# Altium project CSI2-ZCU106-EVK_Rev01.PrjPcb
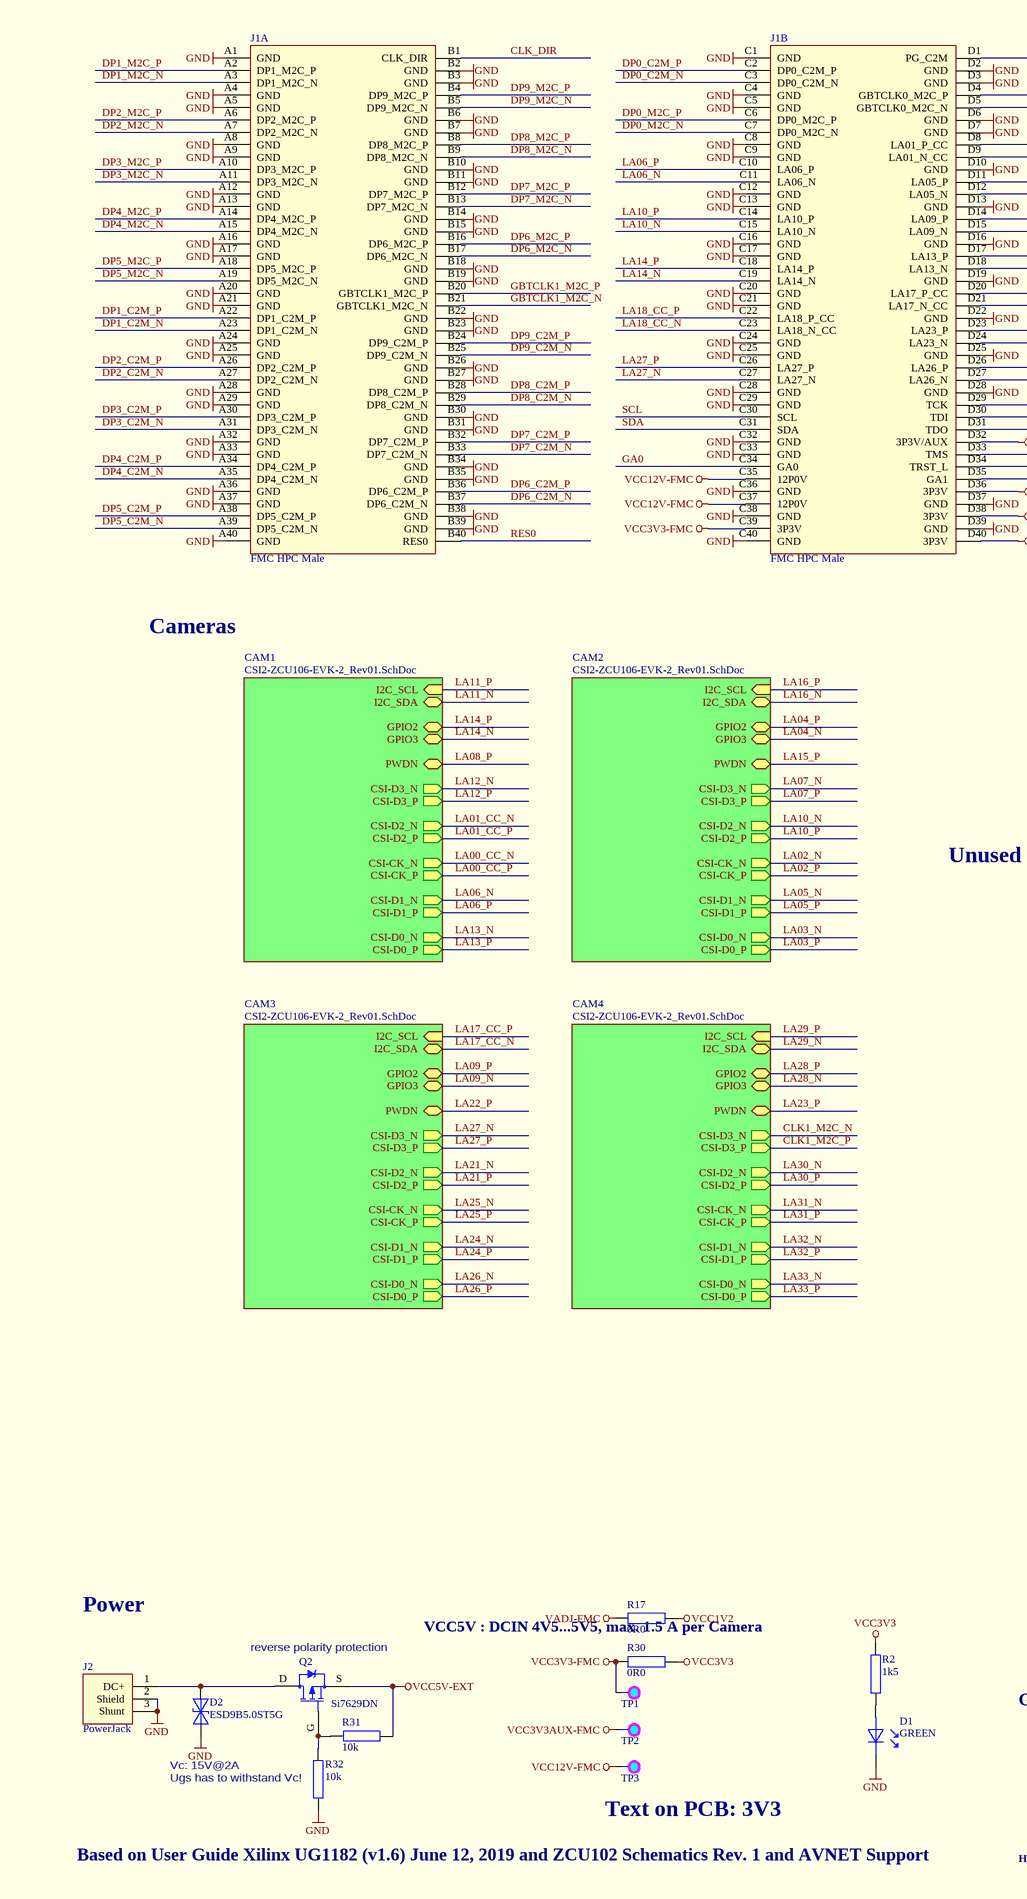
[diagram p0: CSI2-ZCU106-EVK-1_Rev01.SchDoc, left]
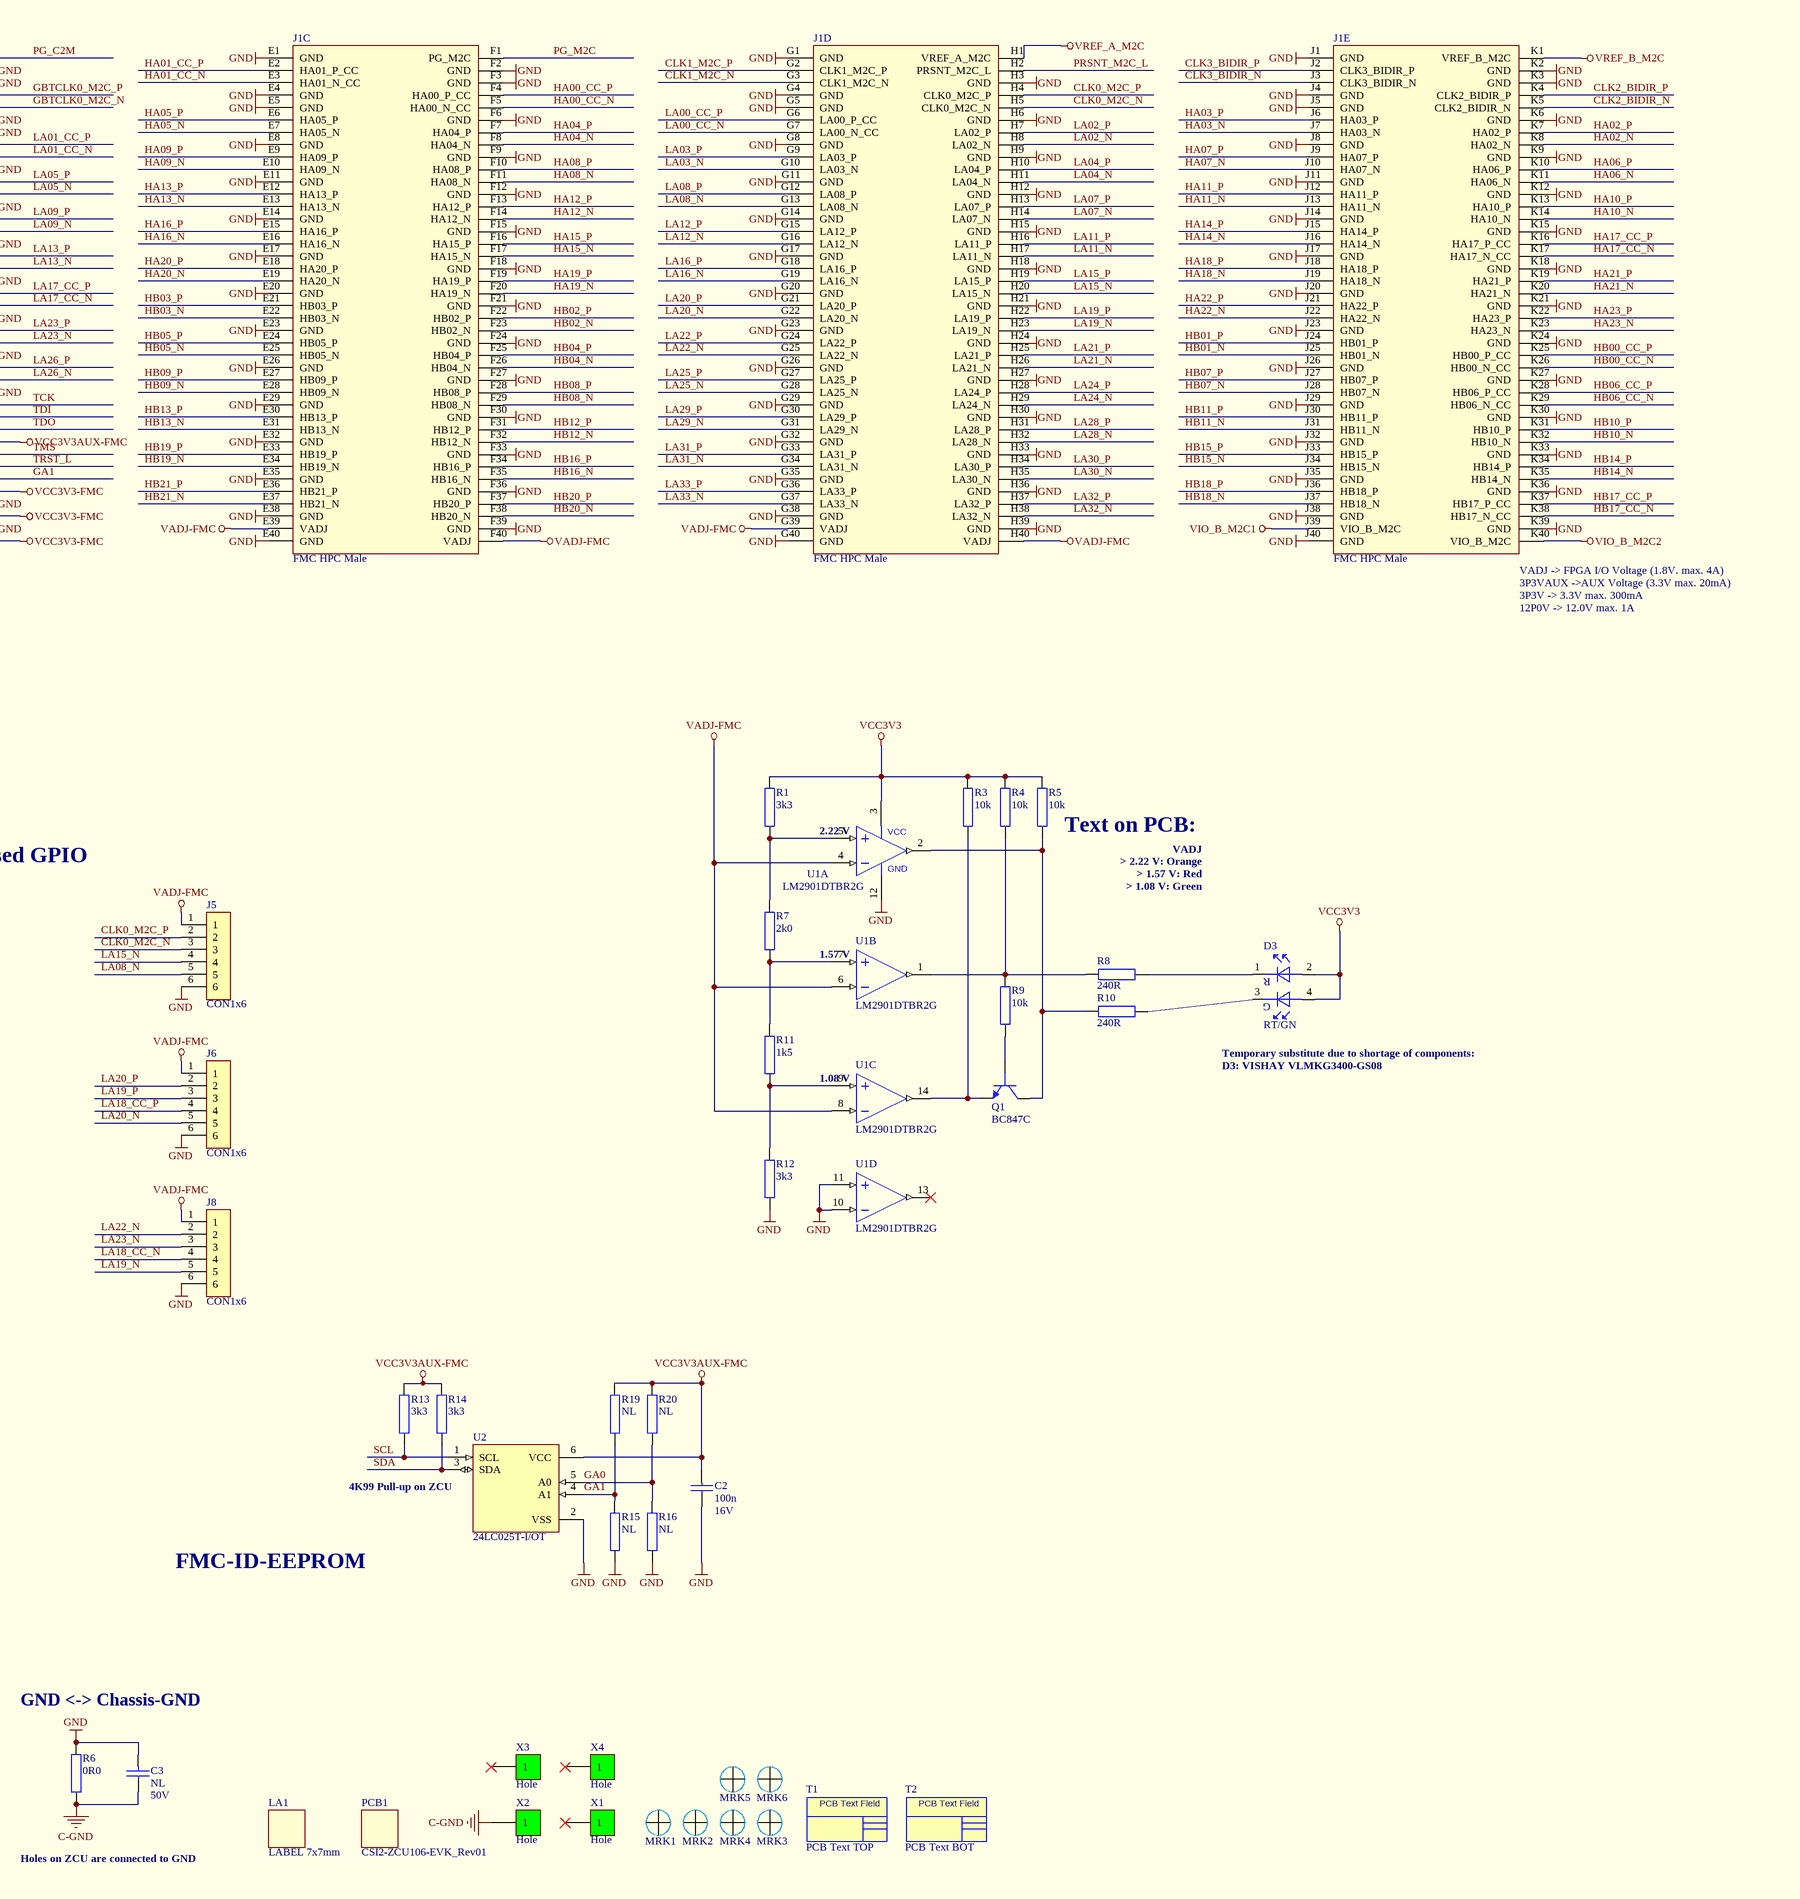
[diagram p1: CSI2-ZCU106-EVK-1_Rev01.SchDoc, right]
AuthorPCB: OFU; RevisionPCB: 01; Title: CSI2-ZCU106-EVK_Rev01; VariantName: standard
2 sheets, 253 parts. Net scope: hierarchical (ports join the sheet entries above them; power ports are global).
Board file: CSI2-ZCU106-EVK_Rev01.PcbDoc
Sheets:
  CSI2-ZCU106-EVK-1_Rev01.SchDoc
    CAM1 = CSI2-ZCU106-EVK-2_Rev01.SchDoc
    CAM2 = CSI2-ZCU106-EVK-2_Rev01.SchDoc
    CAM3 = CSI2-ZCU106-EVK-2_Rev01.SchDoc
    CAM4 = CSI2-ZCU106-EVK-2_Rev01.SchDoc

## Sheet CSI2-ZCU106-EVK-1_Rev01.SchDoc: CSI2-ZCU106-EVK_Rev01
size A2; PageSetup: Record=PageOptions|CenterHorizontal=True|CenterVertical=True|PrintScale=0.71|XCorrection=1.00|YCorrection=1.00|PrintKind=2|BorderSize=5000000|LeftOffset=0|BottomOffset=0|Orientation=2|PaperLength=1000|PaperWidth=1000|Scale=100|PaperSource=7|PrintQuality=-4|MediaType=1|DitherType=10|PrintScaleMode=1|PaperKind=A3; CheckedBy: HW-Devel; Author: CWA; CompanyName: Allied Vision Technologies GmbH; Address1: Taschenweg 2a; Address2: 07646 Stadtroda; Address3: Germany; Revision: 01; SheetNumber: 1; SheetTotal: 2

### Parts
C2  100n  Voltage: 16V  [C-0402_0.55]
C3  NL  Voltage: 50V  [C-0603_1.0]
D1  GREEN  [D-0603-LED]
D2  ESD9B5.0ST5G  [D-SOD923]
D3  RT/GN  [LED-PLCC4]
J1  FMC HPC Male  [J-ASP-134488-01]  (parts A,B,C,D,E of 5)
J2  PowerJack  [CON_RAPC722]
J5  CON1x6  [CON 1x6 RM2.54]
J6  CON1x6  [CON 1x6 RM2.54]
J8  CON1x6  [CON 1x6 RM2.54]
LA1  LABEL 7x7mm  [PCB LABEL 7x7]
MRK1  Marker Single Layer  [PCB_Marker_Pad_top]  (value not drawn)
MRK2  Marker Single Layer  [PCB_Marker_Pad_top]  (value not drawn)
MRK3  Marker Single Layer  [PCB_Marker_Pad_top]  (value not drawn)
MRK4  Marker Single Layer  [PCB_Marker_Pad_top]  (value not drawn)
MRK5  Marker Single Layer  [PCB_Marker_Pad_top]  (value not drawn)
MRK6  Marker Single Layer  [PCB_Marker_Pad_top]  (value not drawn)
PCB1  CSI2-ZCU106-EVK_Rev01  (mechanical)
Q1  BC847C  [IC-SOT23-3]
Q2  Si7629DN  [IC-POWERPAK_1212-8_3.4x3.4x1.1]
R1  3k3  [R-0402_0.4]
R2  1k5  [R-0402_0.4]
R3  10k  [R-0402_0.4]
R4  10k  [R-0402_0.4]
R5  10k  [R-0402_0.4]
R6  0R0  [R-0603_0.6]
R7  2k0  [R-0402_0.4]
R8  240R  [R-0402_0.4]
R9  10k  [R-0402_0.4]
R10  240R  [R-0402_0.4]
R11  1k5  [R-0402_0.4]
R12  3k3  [R-0402_0.4]
R13  3k3  [R-0402_0.4]
R14  3k3  [R-0402_0.4]
R15  NL  [R-0603_0.6]
R16  NL  [R-0603_0.6]
R17  0R0  [R-0603_0.6]
R19  NL  [R-0603_0.6]
R20  NL  [R-0603_0.6]
R30  0R0  [R-0603_0.6]
R31  10k  [R-0402_0.4]
R32  10k  [R-0402_0.4]
T1  PCB Text TOP  [PCB TEXTFIELD TOP 2]  (no BOM)
T2  PCB Text BOT  [PCB TEXTFIELD BOT 2]  (no BOM)
TP1  TP  [TP_16_10]  (value not drawn)  (no BOM)
TP2  TP  [TP_16_10]  (value not drawn)  (no BOM)
TP3  TP  [TP_16_10]  (value not drawn)  (no BOM)
U1  LM2901DTBR2G  [IC-SO14_5.1x6.6x1.2]  (parts A,B,C,D of 4)
U2  24LC025T-I/OT  [IC-SOT23-6]
X1  Hole  [HOLE-2.6-5.0-DK]  (no BOM)
X2  Hole  [HOLE-2.6-5.0-DK]  (no BOM)
X3  Hole  [HOLE-2.6-5.0-DK]  (no BOM)
X4  Hole  [HOLE-2.6-5.0-DK]  (no BOM)

### Sub-sheets
CAM1 = CSI2-ZCU106-EVK-2_Rev01.SchDoc: CSI-D3_N (out), CSI-D3_P (out), CSI-D2_N (out), CSI-D2_P (out), CSI-CK_N (out), CSI-CK_P (out), CSI-D1_N (out), CSI-D1_P (out), CSI-D0_N (out), CSI-D0_P (out), I2C_SCL (in), I2C_SDA (bidir), GPIO3 (bidir), GPIO2 (bidir), PWDN (bidir)
CAM2 = CSI2-ZCU106-EVK-2_Rev01.SchDoc: CSI-D3_N (out), CSI-D3_P (out), CSI-D2_N (out), CSI-D2_P (out), CSI-CK_N (out), CSI-CK_P (out), CSI-D1_N (out), CSI-D1_P (out), CSI-D0_N (out), CSI-D0_P (out), I2C_SCL (in), I2C_SDA (bidir), GPIO3 (bidir), GPIO2 (bidir), PWDN (bidir)
CAM3 = CSI2-ZCU106-EVK-2_Rev01.SchDoc: CSI-D3_N (out), CSI-D3_P (out), CSI-D2_N (out), CSI-D2_P (out), CSI-CK_N (out), CSI-CK_P (out), CSI-D1_N (out), CSI-D1_P (out), CSI-D0_N (out), CSI-D0_P (out), I2C_SCL (in), I2C_SDA (bidir), GPIO3 (bidir), GPIO2 (bidir), PWDN (bidir)
CAM4 = CSI2-ZCU106-EVK-2_Rev01.SchDoc: CSI-D3_N (out), CSI-D3_P (out), CSI-D2_N (out), CSI-D2_P (out), CSI-CK_N (out), CSI-CK_P (out), CSI-D1_N (out), CSI-D1_P (out), CSI-D0_N (out), CSI-D0_P (out), I2C_SCL (in), I2C_SDA (bidir), GPIO3 (bidir), GPIO2 (bidir), PWDN (bidir)

### Nets
C-GND: C3.2 R6.1 X2.1
GND: C2.2 C3.1 D1.K D2.A J1.A1(GND) J1.A4(GND) J1.A5(GND) J1.A8(GND) J1.A9(GND) J1.A12(GND) J1.A13(GND) J1.A16(GND) J1.A17(GND) J1.A20(GND) J1.A21(GND) J1.A24(GND) J1.A25(GND) J1.A28(GND) J1.A29(GND) J1.A32(GND) J1.A33(GND) J1.A36(GND) J1.A37(GND) J1.A40(GND) J1.B2(GND) J1.B3(GND) J1.B6(GND) J1.B7(GND) J1.B10(GND) J1.B11(GND) J1.B14(GND) J1.B15(GND) J1.B18(GND) J1.B19(GND) J1.B22(GND) J1.B23(GND) J1.B26(GND) J1.B27(GND) J1.B30(GND) J1.B31(GND) J1.B34(GND) J1.B35(GND) J1.B38(GND) J1.B39(GND) J1.C1(GND) J1.C4(GND) J1.C5(GND) J1.C8(GND) J1.C9(GND) J1.C12(GND) J1.C13(GND) J1.C16(GND) J1.C17(GND) J1.C20(GND) J1.C21(GND) J1.C24(GND) J1.C25(GND) J1.C28(GND) J1.C29(GND) J1.C32(GND) J1.C33(GND) J1.C36(GND) J1.C38(GND) J1.C40(GND) J1.D2(GND) J1.D3(GND) J1.D6(GND) J1.D7(GND) J1.D10(GND) J1.D13(GND) J1.D16(GND) J1.D19(GND) J1.D22(GND) J1.D25(GND) J1.D28(GND) J1.D37(GND) J1.D39(GND) J1.E1(GND) J1.E4(GND) J1.E5(GND) J1.E8(GND) J1.E11(GND) J1.E14(GND) J1.E17(GND) J1.E20(GND) J1.E23(GND) J1.E26(GND) J1.E29(GND) J1.E32(GND) J1.E35(GND) J1.E38(GND) J1.E40(GND) J1.F2(GND) J1.F3(GND) J1.F6(GND) J1.F9(GND) J1.F12(GND) J1.F15(GND) J1.F18(GND) J1.F21(GND) J1.F24(GND) J1.F27(GND) J1.F30(GND) J1.F33(GND) J1.F36(GND) J1.F39(GND) J1.G1(GND) J1.G4(GND) J1.G5(GND) J1.G8(GND) J1.G11(GND) J1.G14(GND) J1.G17(GND) J1.G20(GND) J1.G23(GND) J1.G26(GND) J1.G29(GND) J1.G32(GND) J1.G35(GND) J1.G38(GND) J1.G40(GND) J1.H3(GND) J1.H6(GND) J1.H9(GND) J1.H12(GND) J1.H15(GND) J1.H18(GND) J1.H21(GND) J1.H24(GND) J1.H27(GND) J1.H30(GND) J1.H33(GND) J1.H36(GND) J1.H39(GND) J1.J1(GND) J1.J4(GND) J1.J5(GND) J1.J8(GND) J1.J11(GND) J1.J14(GND) J1.J17(GND) J1.J20(GND) J1.J23(GND) J1.J26(GND) J1.J29(GND) J1.J32(GND) J1.J35(GND) J1.J38(GND) J1.J40(GND) J1.K2(GND) J1.K3(GND) J1.K6(GND) J1.K9(GND) J1.K12(GND) J1.K15(GND) J1.K18(GND) J1.K21(GND) J1.K24(GND) J1.K27(GND) J1.K30(GND) J1.K33(GND) J1.K36(GND) J1.K39(GND) J2.2(Shield) J2.3(Shunt) J5.6 J6.6 J8.6 R6.2 R12.2 R15.2 R16.2 R32.1 U1.10(IN-) U1.11(IN+) U1.12(GND) U2.2(VSS)
VADJ-FMC: J1.E39(VADJ) J1.F40(VADJ) J1.G39(VADJ) J1.H40(VADJ) J5.1 J6.1 J8.1 R17.1 U1.4(IN-) U1.6(IN-) U1.8(IN-)
VCC1V2: R17.2
VCC3V3: D3.2 D3.4 R1.1 R2.1 R3.1 R4.1 R5.1 R30.2 U1.3(VCC)
VCC3V3-FMC: J1.C39(3P3V) J1.D36(3P3V) J1.D38(3P3V) J1.D40(3P3V) R30.1 TP1.1
VCC3V3AUX-FMC: C2.1 J1.D32(3P3V/AUX) R13.2 R14.2 R19.1 R20.1 TP2.1 U2.6(VCC)
VCC5V-EXT: Q2.S R31.1
VCC12V-FMC: J1.C35(12P0V) J1.C37(12P0V) TP3.1
VIO_B_M2C1: J1.J39(VIO_B_M2C)
VIO_B_M2C2: J1.K40(VIO_B_M2C)
VREF_A_M2C: J1.H1(VREF_A_M2C)
VREF_B_M2C: J1.K1(VREF_B_M2C)
CLK0_M2C_N: J1.H5(CLK0_M2C_N) J5.3
CLK0_M2C_P: J1.H4(CLK0_M2C_P) J5.2
CLK1_M2C_N: J1.G3(CLK1_M2C_N) ; sheet CAM4/CSI-D3_N  [project net B7-CSI2-TXD3_N]
CLK1_M2C_P: J1.G2(CLK1_M2C_P) ; sheet CAM4/CSI-D3_P  [project net B7-CSI2-TXD3_P]
CLK2_BIDIR_N: J1.K5(CLK2_BIDIR_N)
CLK2_BIDIR_P: J1.K4(CLK2_BIDIR_P)
CLK3_BIDIR_N: J1.J3(CLK3_BIDIR_N)
CLK3_BIDIR_P: J1.J2(CLK3_BIDIR_P)
CLK_DIR: J1.B1(CLK_DIR)
DP0_C2M_N: J1.C3(DP0_C2M_N)
DP0_C2M_P: J1.C2(DP0_C2M_P)
DP0_M2C_N: J1.C7(DP0_M2C_N)
DP0_M2C_P: J1.C6(DP0_M2C_P)
DP1_C2M_N: J1.A23(DP1_C2M_N)
DP1_C2M_P: J1.A22(DP1_C2M_P)
DP1_M2C_N: J1.A3(DP1_M2C_N)
DP1_M2C_P: J1.A2(DP1_M2C_P)
DP2_C2M_N: J1.A27(DP2_C2M_N)
DP2_C2M_P: J1.A26(DP2_C2M_P)
DP2_M2C_N: J1.A7(DP2_M2C_N)
DP2_M2C_P: J1.A6(DP2_M2C_P)
DP3_C2M_N: J1.A31(DP3_C2M_N)
DP3_C2M_P: J1.A30(DP3_C2M_P)
DP3_M2C_N: J1.A11(DP3_M2C_N)
DP3_M2C_P: J1.A10(DP3_M2C_P)
DP4_C2M_N: J1.A35(DP4_C2M_N)
DP4_C2M_P: J1.A34(DP4_C2M_P)
DP4_M2C_N: J1.A15(DP4_M2C_N)
DP4_M2C_P: J1.A14(DP4_M2C_P)
DP5_C2M_N: J1.A39(DP5_C2M_N)
DP5_C2M_P: J1.A38(DP5_C2M_P)
DP5_M2C_N: J1.A19(DP5_M2C_N)
DP5_M2C_P: J1.A18(DP5_M2C_P)
DP6_C2M_N: J1.B37(DP6_C2M_N)
DP6_C2M_P: J1.B36(DP6_C2M_P)
DP6_M2C_N: J1.B17(DP6_M2C_N)
DP6_M2C_P: J1.B16(DP6_M2C_P)
DP7_C2M_N: J1.B33(DP7_C2M_N)
DP7_C2M_P: J1.B32(DP7_C2M_P)
DP7_M2C_N: J1.B13(DP7_M2C_N)
DP7_M2C_P: J1.B12(DP7_M2C_P)
DP8_C2M_N: J1.B29(DP8_C2M_N)
DP8_C2M_P: J1.B28(DP8_C2M_P)
DP8_M2C_N: J1.B9(DP8_M2C_N)
DP8_M2C_P: J1.B8(DP8_M2C_P)
DP9_C2M_N: J1.B25(DP9_C2M_N)
DP9_C2M_P: J1.B24(DP9_C2M_P)
DP9_M2C_N: J1.B5(DP9_M2C_N)
DP9_M2C_P: J1.B4(DP9_M2C_P)
GA0: J1.C34(GA0) R16.1 R20.2 U2.5(A0)
GA1: J1.D35(GA1) R15.1 R19.2 U2.4(A1)
GBTCLK0_M2C_N: J1.D5(GBTCLK0_M2C_N)
GBTCLK0_M2C_P: J1.D4(GBTCLK0_M2C_P)
GBTCLK1_M2C_N: J1.B21(GBTCLK1_M2C_N)
GBTCLK1_M2C_P: J1.B20(GBTCLK1_M2C_P)
HA00_CC_N: J1.F5(HA00_N_CC)
HA00_CC_P: J1.F4(HA00_P_CC)
HA01_CC_N: J1.E3(HA01_N_CC)
HA01_CC_P: J1.E2(HA01_P_CC)
HA02_N: J1.K8(HA02_N)
HA02_P: J1.K7(HA02_P)
HA03_N: J1.J7(HA03_N)
HA03_P: J1.J6(HA03_P)
HA04_N: J1.F8(HA04_N)
HA04_P: J1.F7(HA04_P)
HA05_N: J1.E7(HA05_N)
HA05_P: J1.E6(HA05_P)
HA06_N: J1.K11(HA06_N)
HA06_P: J1.K10(HA06_P)
HA07_N: J1.J10(HA07_N)
HA07_P: J1.J9(HA07_P)
HA08_N: J1.F11(HA08_N)
HA08_P: J1.F10(HA08_P)
HA09_N: J1.E10(HA09_N)
HA09_P: J1.E9(HA09_P)
HA10_N: J1.K14(HA10_N)
HA10_P: J1.K13(HA10_P)
HA11_N: J1.J13(HA11_N)
HA11_P: J1.J12(HA11_P)
HA12_N: J1.F14(HA12_N)
HA12_P: J1.F13(HA12_P)
HA13_N: J1.E13(HA13_N)
HA13_P: J1.E12(HA13_P)
HA14_N: J1.J16(HA14_N)
HA14_P: J1.J15(HA14_P)
HA15_N: J1.F17(HA15_N)
HA15_P: J1.F16(HA15_P)
HA16_N: J1.E16(HA16_N)
HA16_P: J1.E15(HA16_P)
HA17_CC_N: J1.K17(HA17_N_CC)
HA17_CC_P: J1.K16(HA17_P_CC)
HA18_N: J1.J19(HA18_N)
HA18_P: J1.J18(HA18_P)
HA19_N: J1.F20(HA19_N)
HA19_P: J1.F19(HA19_P)
HA20_N: J1.E19(HA20_N)
HA20_P: J1.E18(HA20_P)
HA21_N: J1.K20(HA21_N)
HA21_P: J1.K19(HA21_P)
HA22_N: J1.J22(HA22_N)
HA22_P: J1.J21(HA22_P)
HA23_N: J1.K23(HA23_N)
HA23_P: J1.K22(HA23_P)
HB00_CC_N: J1.K26(HB00_N_CC)
HB00_CC_P: J1.K25(HB00_P_CC)
HB01_N: J1.J25(HB01_N)
HB01_P: J1.J24(HB01_P)
HB02_N: J1.F23(HB02_N)
HB02_P: J1.F22(HB02_P)
HB03_N: J1.E22(HB03_N)
HB03_P: J1.E21(HB03_P)
HB04_N: J1.F26(HB04_N)
HB04_P: J1.F25(HB04_P)
HB05_N: J1.E25(HB05_N)
HB05_P: J1.E24(HB05_P)
HB06_CC_N: J1.K29(HB06_N_CC)
HB06_CC_P: J1.K28(HB06_P_CC)
HB07_N: J1.J28(HB07_N)
HB07_P: J1.J27(HB07_P)
HB08_N: J1.F29(HB08_N)
HB08_P: J1.F28(HB08_P)
HB09_N: J1.E28(HB09_N)
HB09_P: J1.E27(HB09_P)
HB10_N: J1.K32(HB10_N)
HB10_P: J1.K31(HB10_P)
HB11_N: J1.J31(HB11_N)
HB11_P: J1.J30(HB11_P)
HB12_N: J1.F32(HB12_N)
HB12_P: J1.F31(HB12_P)
HB13_N: J1.E31(HB13_N)
HB13_P: J1.E30(HB13_P)
HB14_N: J1.K35(HB14_N)
HB14_P: J1.K34(HB14_P)
HB15_N: J1.J34(HB15_N)
HB15_P: J1.J33(HB15_P)
HB16_N: J1.F35(HB16_N)
HB16_P: J1.F34(HB16_P)
HB17_CC_N: J1.K38(HB17_N_CC)
HB17_CC_P: J1.K37(HB17_P_CC)
HB18_N: J1.J37(HB18_N)
HB18_P: J1.J36(HB18_P)
HB19_N: J1.E34(HB19_N)
HB19_P: J1.E33(HB19_P)
HB20_N: J1.F38(HB20_N)
HB20_P: J1.F37(HB20_P)
HB21_N: J1.E37(HB21_N)
HB21_P: J1.E36(HB21_P)
LA00_CC_N: J1.G7(LA00_N_CC) ; sheet CAM1/CSI-CK_N  [project net B7-CSI2-TXC_N]
LA00_CC_P: J1.G6(LA00_P_CC) ; sheet CAM1/CSI-CK_P  [project net B7-CSI2-TXC_P]
LA01_CC_N: J1.D9(LA01_N_CC) ; sheet CAM1/CSI-D2_N  [project net B7-CSI2-TXD2_N]
LA01_CC_P: J1.D8(LA01_P_CC) ; sheet CAM1/CSI-D2_P  [project net B7-CSI2-TXD2_P]
LA02_N: J1.H8(LA02_N) ; sheet CAM2/CSI-CK_N  [project net B7-CSI2-TXC_N]
LA02_P: J1.H7(LA02_P) ; sheet CAM2/CSI-CK_P  [project net B7-CSI2-TXC_P]
LA03_N: J1.G10(LA03_N) ; sheet CAM2/CSI-D0_N  [project net B7-CSI2-TXD0_N]
LA03_P: J1.G9(LA03_P) ; sheet CAM2/CSI-D0_P  [project net B7-CSI2-TXD0_P]
LA04_N: J1.H11(LA04_N) ; sheet CAM2/GPIO3  [project net GPIO3]
LA04_P: J1.H10(LA04_P) ; sheet CAM2/GPIO2  [project net GPIO2]
LA05_N: J1.D12(LA05_N) ; sheet CAM2/CSI-D1_N  [project net B7-CSI2-TXD1_N]
LA05_P: J1.D11(LA05_P) ; sheet CAM2/CSI-D1_P  [project net B7-CSI2-TXD1_P]
LA06_N: J1.C11(LA06_N) ; sheet CAM1/CSI-D1_N  [project net B7-CSI2-TXD1_N]
LA06_P: J1.C10(LA06_P) ; sheet CAM1/CSI-D1_P  [project net B7-CSI2-TXD1_P]
LA07_N: J1.H14(LA07_N) ; sheet CAM2/CSI-D3_N  [project net B7-CSI2-TXD3_N]
LA07_P: J1.H13(LA07_P) ; sheet CAM2/CSI-D3_P  [project net B7-CSI2-TXD3_P]
LA08_N: J1.G13(LA08_N) J5.5
LA08_P: J1.G12(LA08_P) ; sheet CAM1/PWDN
LA09_N: J1.D15(LA09_N) ; sheet CAM3/GPIO3  [project net GPIO3]
LA09_P: J1.D14(LA09_P) ; sheet CAM3/GPIO2  [project net GPIO2]
LA10_N: J1.C15(LA10_N) ; sheet CAM2/CSI-D2_N  [project net B7-CSI2-TXD2_N]
LA10_P: J1.C14(LA10_P) ; sheet CAM2/CSI-D2_P  [project net B7-CSI2-TXD2_P]
LA11_N: J1.H17(LA11_N) ; sheet CAM1/I2C_SDA  [project net I2C_SDA]
LA11_P: J1.H16(LA11_P) ; sheet CAM1/I2C_SCL  [project net I2C_SCL]
LA12_N: J1.G16(LA12_N) ; sheet CAM1/CSI-D3_N  [project net B7-CSI2-TXD3_N]
LA12_P: J1.G15(LA12_P) ; sheet CAM1/CSI-D3_P  [project net B7-CSI2-TXD3_P]
LA13_N: J1.D18(LA13_N) ; sheet CAM1/CSI-D0_N  [project net B7-CSI2-TXD0_N]
LA13_P: J1.D17(LA13_P) ; sheet CAM1/CSI-D0_P  [project net B7-CSI2-TXD0_P]
LA14_N: J1.C19(LA14_N) ; sheet CAM1/GPIO3  [project net GPIO3]
LA14_P: J1.C18(LA14_P) ; sheet CAM1/GPIO2  [project net GPIO2]
LA15_N: J1.H20(LA15_N) J5.4
LA15_P: J1.H19(LA15_P) ; sheet CAM2/PWDN
LA16_N: J1.G19(LA16_N) ; sheet CAM2/I2C_SDA  [project net I2C_SDA]
LA16_P: J1.G18(LA16_P) ; sheet CAM2/I2C_SCL  [project net I2C_SCL]
LA17_CC_N: J1.D21(LA17_N_CC) ; sheet CAM3/I2C_SDA  [project net I2C_SDA]
LA17_CC_P: J1.D20(LA17_P_CC) ; sheet CAM3/I2C_SCL  [project net I2C_SCL]
LA18_CC_N: J1.C23(LA18_N_CC) J8.4
LA18_CC_P: J1.C22(LA18_P_CC) J6.4
LA19_N: J1.H23(LA19_N) J8.5
LA19_P: J1.H22(LA19_P) J6.3
LA20_N: J1.G22(LA20_N) J6.5
LA20_P: J1.G21(LA20_P) J6.2
LA21_N: J1.H26(LA21_N) ; sheet CAM3/CSI-D2_N  [project net B7-CSI2-TXD2_N]
LA21_P: J1.H25(LA21_P) ; sheet CAM3/CSI-D2_P  [project net B7-CSI2-TXD2_P]
LA22_N: J1.G25(LA22_N) J8.2
LA22_P: J1.G24(LA22_P) ; sheet CAM3/PWDN
LA23_N: J1.D24(LA23_N) J8.3
LA23_P: J1.D23(LA23_P) ; sheet CAM4/PWDN
LA24_N: J1.H29(LA24_N) ; sheet CAM3/CSI-D1_N  [project net B7-CSI2-TXD1_N]
LA24_P: J1.H28(LA24_P) ; sheet CAM3/CSI-D1_P  [project net B7-CSI2-TXD1_P]
LA25_N: J1.G28(LA25_N) ; sheet CAM3/CSI-CK_N  [project net B7-CSI2-TXC_N]
LA25_P: J1.G27(LA25_P) ; sheet CAM3/CSI-CK_P  [project net B7-CSI2-TXC_P]
LA26_N: J1.D27(LA26_N) ; sheet CAM3/CSI-D0_N  [project net B7-CSI2-TXD0_N]
LA26_P: J1.D26(LA26_P) ; sheet CAM3/CSI-D0_P  [project net B7-CSI2-TXD0_P]
LA27_N: J1.C27(LA27_N) ; sheet CAM3/CSI-D3_N  [project net B7-CSI2-TXD3_N]
LA27_P: J1.C26(LA27_P) ; sheet CAM3/CSI-D3_P  [project net B7-CSI2-TXD3_P]
LA28_N: J1.H32(LA28_N) ; sheet CAM4/GPIO3  [project net GPIO3]
LA28_P: J1.H31(LA28_P) ; sheet CAM4/GPIO2  [project net GPIO2]
LA29_N: J1.G31(LA29_N) ; sheet CAM4/I2C_SDA  [project net I2C_SDA]
LA29_P: J1.G30(LA29_P) ; sheet CAM4/I2C_SCL  [project net I2C_SCL]
LA30_N: J1.H35(LA30_N) ; sheet CAM4/CSI-D2_N  [project net B7-CSI2-TXD2_N]
LA30_P: J1.H34(LA30_P) ; sheet CAM4/CSI-D2_P  [project net B7-CSI2-TXD2_P]
LA31_N: J1.G34(LA31_N) ; sheet CAM4/CSI-CK_N  [project net B7-CSI2-TXC_N]
LA31_P: J1.G33(LA31_P) ; sheet CAM4/CSI-CK_P  [project net B7-CSI2-TXC_P]
LA32_N: J1.H38(LA32_N) ; sheet CAM4/CSI-D1_N  [project net B7-CSI2-TXD1_N]
LA32_P: J1.H37(LA32_P) ; sheet CAM4/CSI-D1_P  [project net B7-CSI2-TXD1_P]
LA33_N: J1.G37(LA33_N) ; sheet CAM4/CSI-D0_N  [project net B7-CSI2-TXD0_N]
LA33_P: J1.G36(LA33_P) ; sheet CAM4/CSI-D0_P  [project net B7-CSI2-TXD0_P]
PG_C2M: J1.D1(PG_C2M)
PG_M2C: J1.F1(PG_M2C)
PRSNT_M2C_L: J1.H2(PRSNT_M2C_L)
RES0: J1.B40(RES0)
SCL: J1.C30(SCL) R13.1 U2.1(SCL)
SDA: J1.C31(SDA) R14.1 U2.3(SDA)
TCK: J1.D29(TCK)
TDI: J1.D30(TDI)
TDO: J1.D31(TDO)
TMS: J1.D33(TMS)
TRST_L: J1.D34(TRST_L)
NetD1_A: D1.A R2.2
NetD2_K: D2.K J2.1(DC+) Q2.D
NetD3_1: D3.1 R8.2
NetD3_3: D3.3 R10.2
NetQ1_1: Q1.1(B) R9.2
NetQ1_2: Q1.2(E) R3.2 U1.14(OUT)
NetQ1_3: Q1.3(C) R5.2 R10.1 U1.2(OUT)
NetQ2_G: Q2.G R31.2 R32.2
NetR1_2: R1.2 R7.1 U1.5(IN+)
NetR4_2: R4.2 R8.1 R9.1 U1.1(OUT)
NetR7_2: R7.2 R11.1 U1.7(IN+)
NetR11_2: R11.2 R12.1 U1.9(IN+)

Not connected (* = marked no-connect by the designer): U1 13(OUT)*; X1 1*; X3 1*; X4 1*

### Notes on the sheet
- (near J1) VADJ -> FPGA I/O Voltage (1.8V. max. 4A)
- Cameras
- (near J1) 3P3VAUX ->AUX Voltage (3.3V max. 20mA)
- 3P3V -> 3.3V max. 300mA
- 12P0V -> 12.0V max. 1A
- Unused GPIO
- (near R1) 2.22 V
- Text on PCB:
- > 2.22 V: Orange
- > 1.57 V: Red
- VADJ
- > 1.08 V: Green
- (near R7) 1.57 V
- Temporary substitute due to shortage of components:
- D3: VISHAY VLMKG3400-GS08
- (near R11) 1.08 V
- (near U2) 4K99 Pull-up on ZCU
- (near U2) FMC-ID-EEPROM
- Power
- (near Q2) reverse polarity protection
- VCC5V : DCIN 4V5...5V5, max. 1.5 A per Camera
- GND <-> Chassis-GND
- (near D2) Vc: 15V@2A
- (near R32) Ugs has to withstand Vc!
- (near D1) Text on PCB: 3V3
- (near R32) Based on User Guide Xilinx UG1182 (v1.6) June 12, 2019 and ZCU102 Schematics Rev. 1 and AVNET Support
- Holes on ZCU are connected to GND
- Author:
- Title:
- PCB:
- Checked by:
- PCBA:
- 2
- 3
- Confidential
- File:
- Date:
- Page:
- of
- No.
- 1
- Changes
- Rev.:
- Name:
- (in symbol D LSG T67K-JL-1+HK-1) R; G
- (in symbol PCB TEXT FIELD BOT) PCB Text Field
- (in symbol PCB TEXT FIELD TOP) PCB Text Field

### Library data of the parts
C2 = C 100N 10% 16V X7R 402: Capacitor Ceramic SMD/0402/16V/X7R/10%; KHK Part Number: K8340114; Manufacturer: several; Dielectric: X7R; Tolerance: 10%; Manufacturer Part Number: several; Supplier 1: Digi-Key; Supplier 2: Digi-Key; Supplier Part Number 1: 1276-1508-1-ND; Supplier Part Number 2: 311-1338-1-ND
C3 = C X 0603: Capacitor Ceramic SMD/0603/50V/X7R/10%; Manufacturer: several; Dielectric: X7R; Tolerance: 10%; Manufacturer Part Number: several
D1 = D LED 0603 green: Chip LED green 430mcd; KHK Part Number: 8172; Manufacturer: Würth; Manufacturer Part Number: 150060GS75000; Current: 20mA; Color: green; Supplier 1: Digi-Key; Supplier Part Number 1: 732-4971-1-ND
D2 = D ESD9B5.0ST5G: DIODE TVS; 400W; 5.8-7.8V; BIDIRECT; KHK Part Number: 7250; Manufacturer: ON Semiconductor; Manufacturer Part Number: ESD9B5.0ST5G; Supplier 1: Digi-Key; Supplier Part Number 1: ESD9B5.0ST5GOSCT-ND
D3 = D LSG T67K-JL-1+HK-1: LED red/green; KHK Part Number: 11105; Manufacturer: OSRAM; Manufacturer Part Number: LSG T67K-JL-1+HK-1; Supplier 1: Digi-Key; Supplier Part Number 1: 475-3435-1-ND
J1 = CON FMC HPC Male: CON FMC HPC MALE 10MM; Manufacturer: Samtec; Manufacturer Part Number: ASP-134488-01; KHK Part Number: 9159; Supplier 1: Digi-Key; Supplier Part Number 1: SAM8730-ND
J2 = CON RAPC722: Switchcraft PowerJack RAPC722 / 2.1mm (Inner) / 6mm (Outer); KHK Part Number: K7600556; Manufacturer Part Number: RAPC722X; Manufacturer: Switchcraft; Supplier 1: Digi-Key; Supplier Part Number 1: SC1313-ND
J5 J6 J8 = CON 1x6 2.54 several: Header Vertical, 1x6 Pos, Pitch 2.54mm, Contact Length Mating 6.00mm, Contact Length Post 3.00mm, Insulation Height 2.54mm, Gold Plating; KHK Part Number: 15686; Manufacturer: several; Manufacturer Part Number: several; Supplier 1: Digi-Key; Supplier Part Number 1: 732-5319-ND
LA1 = PCB LABEL 7x7: Manufacturer: several; Manufacturer Part Number: several
MRK1-MRK6 = PCB Marker Pad Single Layer: Position Marker for PCBs
PCB1 = PCB: PCB ML04SF; Manufacturer: several
Q1 = Q BC847C SOT23: TRANSISTOR NPN 100mA 45V; Manufacturer: several; KHK Part Number: 16587; Manufacturer Part Number: BC847C; Supplier 1: Digi-Key; Supplier Part Number 1: BC847CE6327HTSA1CT-ND
Q2 = Q Si7629DN: P-Channel MOSFET 20V; KHK Part Number: 3619; Manufacturer: Vishay; Manufacturer Part Number: Si7629DN; Supplier 1: Digi-Key; Supplier Part Number 1: SI7629DN-T1-GE3CT-ND
R1 R12-R14 = R 3k3 1% 0402: Standard Resistor SMD/0402/1%/63mW/TK100; KHK Part Number: K8250347; Manufacturer: several; Tolerance: 1%; Temperature Coefficient: TK100; Manufacturer Part Number: several; Supplier 1: Digi-Key; Supplier Part Number 1: 311-3.30KLRCT-ND
R2 R11 = R 1K5 1% 0402: Standard Resistor SMD/0402/1%/63mW/TK100; KHK Part Number: K8250358; Manufacturer: several; Tolerance: 1%; Manufacturer Part Number: several; Supplier 1: Digi-Key; Supplier Part Number 1: 311-1.50KLRCT-ND
R3-R5 R9 R31 R32 = R 10K 1% 0402: Standard Resistor SMD/0402/1%/63mW/TK100; KHK Part Number: K8250264; Manufacturer: several; Temperature Coefficient: TK100; Tolerance: 1%; Manufacturer Part Number: several; Supplier 1: Digi-Key; Supplier 2: Farnell; Supplier 3: RSComponents; Supplier 4: Digi-Key; Supplier Part Number 1: CR0402-FX-1002GLFCT-ND; Supplier Part Number 2: 2421890; Supplier Part Number 3: 6678848P; Supplier Part Number 4: 541-10.0KLCT-ND
R6 R17 R30 = R 0R0 1% 0603: Standard Resistor SMD/0603/1%/100mW/TK200; KHK Part Number: K8250041; Manufacturer: several; Tolerance: 1%; Manufacturer Part Number: several; Temperature Coefficient: *; Supplier 1: Digi-Key; Supplier Part Number 1: 311-0.0HRCT-ND
R7 = R 2k0 1% 0402: Standard Resistor SMD/0402/1%/63mW/TK100; KHK Part Number: K8250311; Manufacturer: several; Tolerance: 1%; Temperature Coefficient: TK100; Manufacturer Part Number: several; Supplier 1: Digi-Key; Supplier Part Number 1: 311-2KLRCT-ND
R8 R10 = R 240R 1% 0402: Standard Resistor SMD/0402/1%/63mW/TK100; KHK Part Number: 7256; Manufacturer: several; Tolerance: 1%; Temperature Coefficient: TK100; Manufacturer Part Number: several; Supplier 1: Digi-Key; Supplier Part Number 1: YAG3461CT-ND
R15 R16 R19 R20 = R X 0603: Standard Resistor SMD/0603/1%/100mW/TK200; Temperature Coefficient: TK100; Tolerance: 1%
T1 = PCB TEXT FIELD TOP: PCB Textfield TOP
T2 = PCB TEXT FIELD BOT: PCB Textfield BOT
TP1-TP3 = TP_16_10: Testpoint: Pad=1,6mm; Hole=1,0mm
U1 = IC LM2901DTBR2G: QUAD COMPERATOR; Manufacturer: ON Semi; Manufacturer Part Number: LM2901DTBR2G; Supplier 1: Digi-Key; Supplier Part Number 1: LM2901DTBR2GOSCT-ND
U2 = IC 24LC025T-I/OT: 2K I2C Serial EEPROM 2V5-5V5; KHK Part Number: 9217; Manufacturer: Microchip; Manufacturer Part Number: 24LC025T-I/OT; Supplier 1: Digi-Key; Supplier Part Number 1: 24LC025T-I/OTCT-ND
X1-X4 = PCB HOLE M2.5-5-DK: HOLE M2.5

## Sheet CSI2-ZCU106-EVK-2_Rev01.SchDoc: CSI2-ZCU106-EVK_Rev01
size A2; PageSetup: Record=PageOptions|CenterHorizontal=True|CenterVertical=True|PrintScale=0.71|XCorrection=1.00|YCorrection=1.00|PrintKind=2|BorderSize=5000000|LeftOffset=0|BottomOffset=0|Orientation=2|PaperLength=1000|PaperWidth=1000|Scale=100|PaperSource=7|PrintQuality=-4|MediaType=1|DitherType=10|PrintScaleMode=1|PaperKind=A3; CheckedBy: HW-Devel; Author: CWA; CompanyName: Allied Vision Technologies GmbH; Address1: Taschenweg 2a; Address2: 07646 Stadtroda; Address3: Germany; Revision: 01; SheetNumber: 2; SheetTotal: 2
Used 4 times, as channels CAM1, CAM2, CAM3, CAM4. Parts and nets are listed once, with the designators drawn on the sheet.
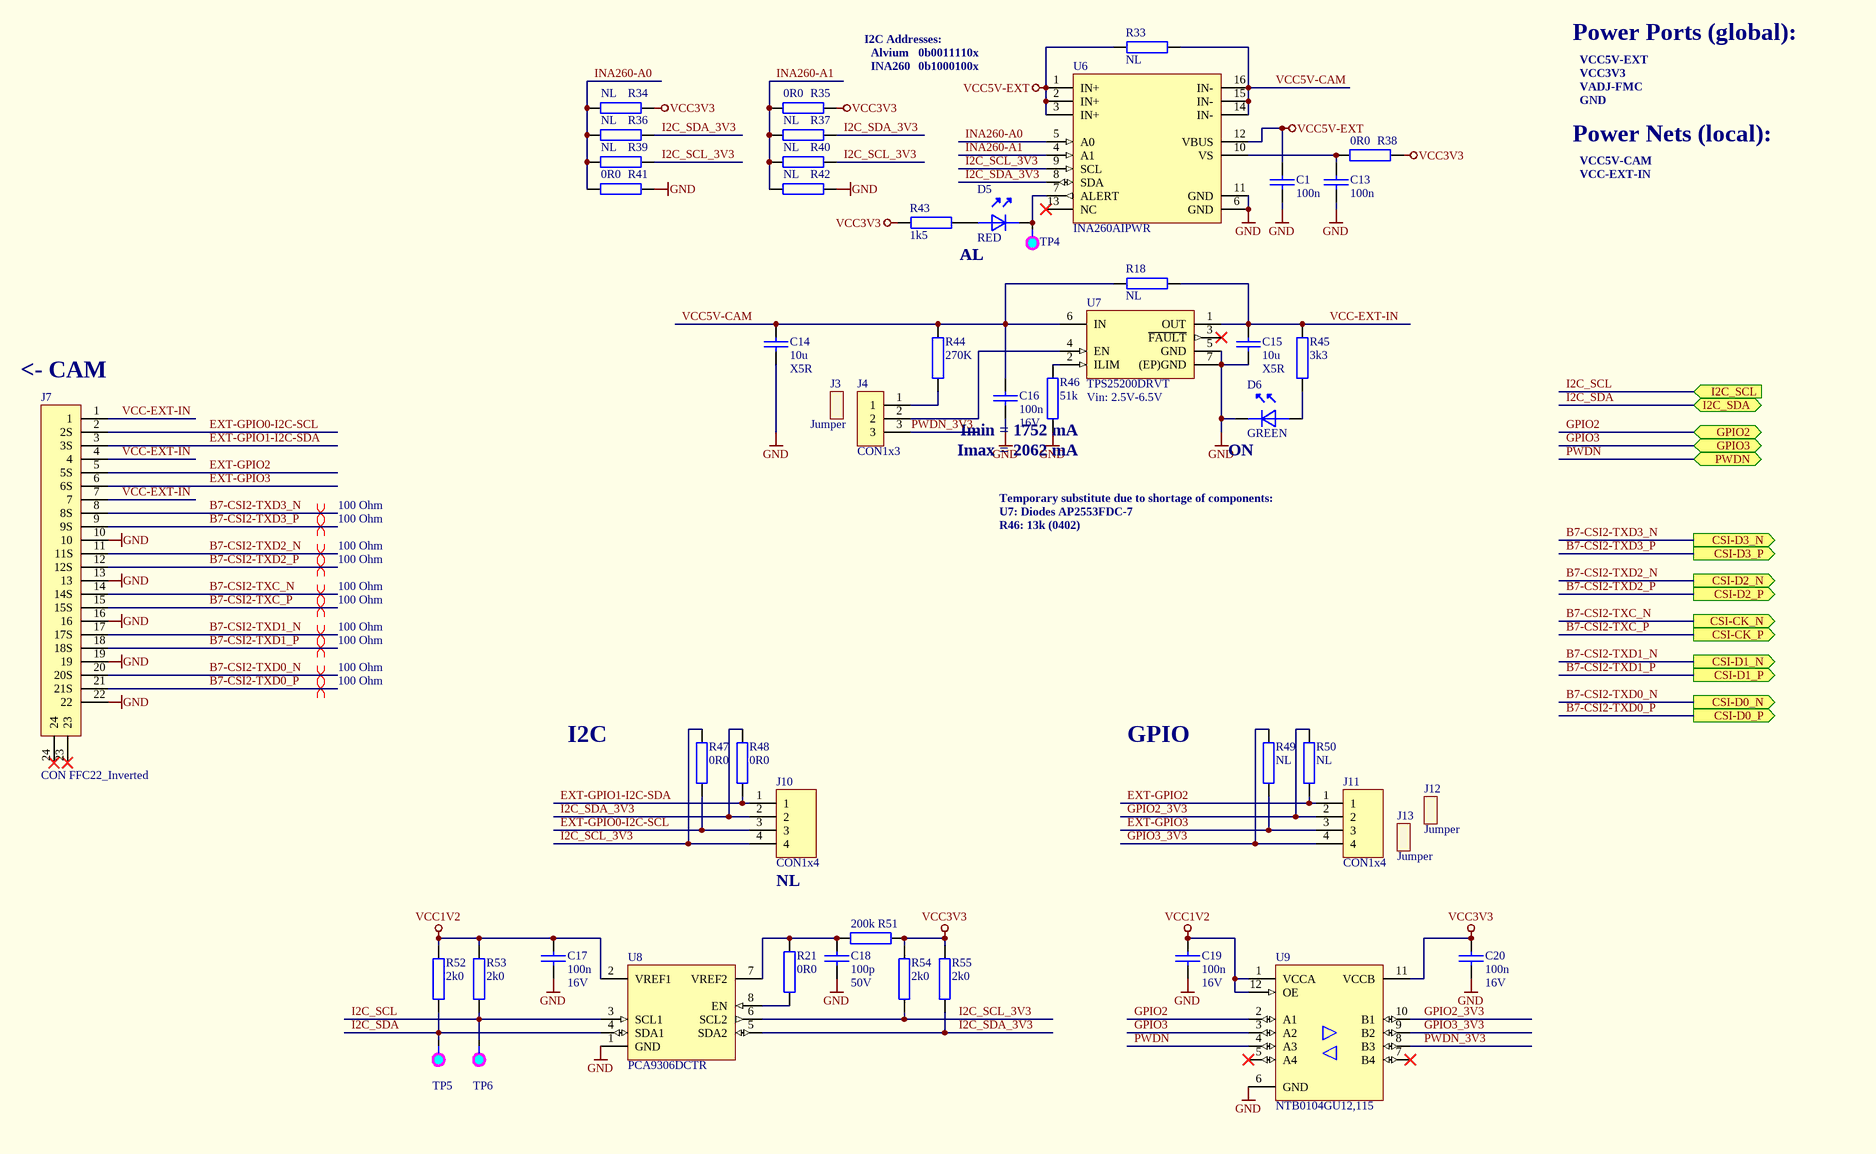
[diagram p2: CSI2-ZCU106-EVK-2_Rev01.SchDoc]

### Parts
C1  100n  [C-0402_0.55]
C13  100n  [C-0402_0.55]
C14  10u  Dielectric: X5R  [C-0805_1.4]
C15  10u  Dielectric: X5R  [C-0805_1.4]
C16  100n  Voltage: 16V  [C-0402_0.55]
C17  100n  Voltage: 16V  [C-0402_0.55]
C18  100p  Voltage: 50V  [C-0402_0.55]
C19  100n  Voltage: 16V  [C-0402_0.55]
C20  100n  Voltage: 16V  [C-0402_0.55]
D5  RED  [D-0603-LED]
D6  GREEN  [D-0603-LED]
J3  Jumper  [J-JUMPER-2.54]
J4  CON1x3  [CON 1x3 RM2.54]
J7  CON FFC22_Inverted  [J-FH55-22S-0.5SH - Inverted Pins]
J10  CON1x4  [CON 1x4 RM2.54]
J11  CON1x4  [CON 1x4 RM2.54]
J12  Jumper  [J-JUMPER-2.54]
J13  Jumper  [J-JUMPER-2.54]
R18  NL  [R-0603_0.6]
R21  0R0  [R-0603_0.6]
R33  NL  [R-0603_0.6]
R34  NL  [R-0603_0.6]
R35  0R0  [R-0603_0.6]
R36  NL  [R-0603_0.6]
R37  NL  [R-0603_0.6]
R38  0R0  [R-0603_0.6]
R39  NL  [R-0603_0.6]
R40  NL  [R-0603_0.6]
R41  0R0  [R-0603_0.6]
R42  NL  [R-0603_0.6]
R43  1k5  [R-0402_0.4]
R44  270K  [R-0402_0.4]
R45  3k3  [R-0402_0.4]
R46  51k  [R-0402_0.4]
R47  0R0  [R-0603_0.6]
R48  0R0  [R-0603_0.6]
R49  NL  [R-0603_0.6]
R50  NL  [R-0603_0.6]
R51  200k  [R-0402_0.4]
R52  2k0  [R-0402_0.4]
R53  2k0  [R-0402_0.4]
R54  2k0  [R-0402_0.4]
R55  2k0  [R-0402_0.4]
TP4  TP  [TP_16_10]  (value not drawn)  (no BOM)
TP5  TP  [TP_16_10]  (value not drawn)  (no BOM)
TP6  TP  [TP_16_10]  (value not drawn)  (no BOM)
U6  INA260AIPWR  [IC-TSSOP16 6.4x5.1x1.2]
U7  TPS25200DRVT  Vin: 2.5V-6.5V  [IC-DFN06_2.0x2.0x0.8]
U8  PCA9306DCTR  [IC-TSSOP8_3.15x4.25x1.3]
U9  NTB0104GU12,115  [IC-XQFN12_1.7x2x0.5]

### Ports
CSI-CK_N (out), CSI-CK_P (out), CSI-D0_N (out), CSI-D0_P (out), CSI-D1_N (out), CSI-D1_P (out), CSI-D2_N (out), CSI-D2_P (out), CSI-D3_N (out), CSI-D3_P (out), GPIO2 (bidir), GPIO3 (bidir), I2C_SCL (in), I2C_SDA (bidir), PWDN (bidir)

### Nets
GND: C1.2 C13.2 C14.2 C15.2 C16.2 C17.2 C18.2 C19.2 C20.2 D6.K J7.10 J7.13 J7.16 J7.19 J7.22 R41.1 R42.1 R46.1 U6.6(GND) U6.11(GND) U7.5(GND) U7.7((EP)GND) U8.1(GND) U9.6(GND)
VCC1V2: C17.1 C19.1 R52.1 R53.1 U8.2(VREF1) U9.1(VCCA) U9.12(OE)
VCC3V3: C20.1 R34.1 R35.1 R38.1 R43.1 R51.2 R54.2 R55.2 U9.11(VCCB)
VCC5V-EXT: C1.1 R33.2 U6.1(IN+) U6.2(IN+) U6.3(IN+) U6.12(VBUS)
B7-CSI2-TXC_N: J7.14(14S) ; port CSI-CK_N
B7-CSI2-TXC_P: J7.15(15S) ; port CSI-CK_P
B7-CSI2-TXD0_N: J7.20(20S) ; port CSI-D0_N
B7-CSI2-TXD0_P: J7.21(21S) ; port CSI-D0_P
B7-CSI2-TXD1_N: J7.17(17S) ; port CSI-D1_N
B7-CSI2-TXD1_P: J7.18(18S) ; port CSI-D1_P
B7-CSI2-TXD2_N: J7.11(11S) ; port CSI-D2_N
B7-CSI2-TXD2_P: J7.12(12S) ; port CSI-D2_P
B7-CSI2-TXD3_N: J7.8(8S) ; port CSI-D3_N
B7-CSI2-TXD3_P: J7.9(9S) ; port CSI-D3_P
EXT-GPIO0-I2C-SCL: J7.2(2S) J10.3 R47.1
EXT-GPIO1-I2C-SDA: J7.3(3S) J10.1 R48.1
EXT-GPIO2: J7.5(5S) J11.1 R50.1
EXT-GPIO3: J7.6(6S) J11.3 R49.1
GPIO2: U9.2(A1) ; port GPIO2
GPIO2_3V3: J11.2 R50.2 U9.10(B1)
GPIO3: U9.3(A2) ; port GPIO3
GPIO3_3V3: J11.4 R49.2 U9.9(B2)
I2C_SCL: R53.2 TP6.1 U8.3(SCL1) ; port I2C_SCL
I2C_SCL_3V3: J10.4 R39.1 R40.1 R47.2 R54.1 U6.9(SCL) U8.6(SCL2)
I2C_SDA: R52.2 TP5.1 U8.4(SDA1) ; port I2C_SDA
I2C_SDA_3V3: J10.2 R36.1 R37.1 R48.2 R55.1 U6.8(SDA) U8.5(SDA2)
INA260-A0: R34.2 R36.2 R39.2 R41.2 U6.5(A0)
INA260-A1: R35.2 R37.2 R40.2 R42.2 U6.4(A1)
PWDN: U9.4(A3) ; port PWDN
PWDN_3V3: J4.3 U9.8(B3)
VCC5V-CAM: C14.1 C16.1 R18.2 R33.1 R44.1 U6.14(IN-) U6.15(IN-) U6.16(IN-) U7.6(IN)
VCC-EXT-IN: C15.1 J7.1 J7.4 J7.7 R18.1 R45.1 U7.1(OUT)
NetC13_1: C13.1 R38.2 U6.10(VS)
NetC18_1: C18.1 R21.1 R51.1 U8.7(VREF2)
NetD5_A: D5.A R43.2
NetD5_K: D5.K TP4.1 U6.7(ALERT)
NetD6_A: D6.A R45.2
NetJ4_1: J4.1 R44.2
NetJ4_2: J4.2 U7.4(EN)
NetR21_2: R21.2 U8.8(EN)
NetR46_2: R46.2 U7.2(ILIM)

Not connected (* = marked no-connect by the designer): J7 23* 24*; U6 13(NC)*; U7 3(~{FAULT})*; U9 5(A4)* 7(B4)*

### Channels
CAM1: designators end in _CAM1; ports CSI-CK_N=B7-CSI2-TXC_N CSI-CK_P=B7-CSI2-TXC_P CSI-D0_N=B7-CSI2-TXD0_N CSI-D0_P=B7-CSI2-TXD0_P CSI-D1_N=B7-CSI2-TXD1_N CSI-D1_P=B7-CSI2-TXD1_P CSI-D2_N=B7-CSI2-TXD2_N CSI-D2_P=B7-CSI2-TXD2_P CSI-D3_N=B7-CSI2-TXD3_N CSI-D3_P=B7-CSI2-TXD3_P GPIO2=GPIO2 GPIO3=GPIO3 I2C_SCL=I2C_SCL I2C_SDA=I2C_SDA PWDN=LA08_P
CAM2: designators end in _CAM2; ports CSI-CK_N=B7-CSI2-TXC_N CSI-CK_P=B7-CSI2-TXC_P CSI-D0_N=B7-CSI2-TXD0_N CSI-D0_P=B7-CSI2-TXD0_P CSI-D1_N=B7-CSI2-TXD1_N CSI-D1_P=B7-CSI2-TXD1_P CSI-D2_N=B7-CSI2-TXD2_N CSI-D2_P=B7-CSI2-TXD2_P CSI-D3_N=B7-CSI2-TXD3_N CSI-D3_P=B7-CSI2-TXD3_P GPIO2=GPIO2 GPIO3=GPIO3 I2C_SCL=I2C_SCL I2C_SDA=I2C_SDA PWDN=LA15_P
CAM3: designators end in _CAM3; ports CSI-CK_N=B7-CSI2-TXC_N CSI-CK_P=B7-CSI2-TXC_P CSI-D0_N=B7-CSI2-TXD0_N CSI-D0_P=B7-CSI2-TXD0_P CSI-D1_N=B7-CSI2-TXD1_N CSI-D1_P=B7-CSI2-TXD1_P CSI-D2_N=B7-CSI2-TXD2_N CSI-D2_P=B7-CSI2-TXD2_P CSI-D3_N=B7-CSI2-TXD3_N CSI-D3_P=B7-CSI2-TXD3_P GPIO2=GPIO2 GPIO3=GPIO3 I2C_SCL=I2C_SCL I2C_SDA=I2C_SDA PWDN=LA22_P
CAM4: designators end in _CAM4; ports CSI-CK_N=B7-CSI2-TXC_N CSI-CK_P=B7-CSI2-TXC_P CSI-D0_N=B7-CSI2-TXD0_N CSI-D0_P=B7-CSI2-TXD0_P CSI-D1_N=B7-CSI2-TXD1_N CSI-D1_P=B7-CSI2-TXD1_P CSI-D2_N=B7-CSI2-TXD2_N CSI-D2_P=B7-CSI2-TXD2_P CSI-D3_N=B7-CSI2-TXD3_N CSI-D3_P=B7-CSI2-TXD3_P GPIO2=GPIO2 GPIO3=GPIO3 I2C_SCL=I2C_SCL I2C_SDA=I2C_SDA PWDN=LA23_P

### Layout directives
differential pair; net class 100 Ohm: B7-CSI2-TXC_N, B7-CSI2-TXC_P, B7-CSI2-TXD0_N, B7-CSI2-TXD0_P, B7-CSI2-TXD1_N, B7-CSI2-TXD1_P, B7-CSI2-TXD2_N, B7-CSI2-TXD2_P, B7-CSI2-TXD3_N, B7-CSI2-TXD3_P

### Notes on the sheet
- I2C Addresses:
- Alvium
- INA260
- 0b0011110x
- 0b1000100x
- Power Ports (global):
- VCC5V-EXT
- VCC3V3
- Power Nets (local):
- VADJ-FMC
- GND
- VCC5V-CAM
- VCC-EXT-IN
- AL
- (near J7) <- CAM
- (near R46) Imin = 1752 mA
- Imax = 2062 mA
- (near D6) ON
- Temporary substitute due to shortage of components:
- U7: Diodes AP2553FDC-7
- R46: 13k (0402)
- I2C
- GPIO
- (near J10) NL
- Author:
- Title:
- PCB:
- Checked by:
- PCBA:
- 2
- 3
- Confidential
- File:
- Date:
- Page:
- of
- No.
- 1
- Changes
- Rev.:
- Name:

### Library data of the parts
C1 C13 = C 100N 10% 16V X7R 402: Capacitor Ceramic SMD/0402/16V/X7R/10%; KHK Part Number: K8340114; Manufacturer: several; Dielectric: X7R; Tolerance: 10%; Voltage: 16V; Manufacturer Part Number: several; Supplier 1: Digi-Key; Supplier 2: Digi-Key; Supplier Part Number 1: 1276-1508-1-ND; Supplier Part Number 2: 311-1338-1-ND
C14 C15 = C 10U 16V X5R 0805: Capacitor Ceramic SMD/0805/16V/X5R/10%; KHK Part Number: K8340151; Manufacturer: several; Tolerance: 10%; Voltage: 16V; Manufacturer Part Number: several; Supplier 1: Digi-Key; Supplier Part Number 1: 478-5165-1-ND
C16 C17 C19 C20 = C 100N 10% 16V X7R 402: as C2 on sheet CSI2-ZCU106-EVK-1_Rev01; Manufacturer Part Number: several; Supplier 1: Digi-Key; Supplier 2: Digi-Key; Supplier Part Number 1: 1276-1508-1-ND; Supplier Part Number 2: 311-1338-1-ND
C18 = C 100P 50V X7R 0402: Capacitor Ceramic SMD/0402/50V/X7R/10%; KHK Part Number: K8340145; Manufacturer: several; Dielectric: X7R; Tolerance: 10%; Manufacturer Part Number: several; Supplier 1: Digi-Key; Supplier Part Number 1: 478-1089-1-ND
D5 = D LED 0603 red: Chip LED red 250mcd; KHK Part Number: 8145; Manufacturer: Würth; Manufacturer Part Number: 150060RS75000; Current: 20mA; Color: red; Supplier 1: Digi-Key; Supplier Part Number 1: 732-4978-1-ND
D6 = D LED 0603 green: as D1 on sheet CSI2-ZCU106-EVK-1_Rev01; Color: green; Supplier 1: Digi-Key; Supplier Part Number 1: 732-4971-1-ND
J3 J12 J13 = CON Jumper 2.54mm: CON/JUMPER/STC02SYAN; 2-pin; 2.54mm; 3A; FEMALE; VERTICAL; BLACK; KHK Part Number: 13444; Manufacturer: several; Manufacturer Part Number: several; Supplier 1: Digi-Key; Supplier Part Number 1: S9000-ND
J4 = CON 1x3 2.54 several: Header Vertical, 1x3 Pos, Pitch 2.54mm, Contact Length Mating 6.00mm, Contact Length Post 3.00mm, Insulation Height 2.54mm, Gold Plating; KHK Part Number: 15338; Manufacturer: several; Manufacturer Part Number: several; Supplier 1: Digi-Key; Supplier Part Number 1: 732-5316-ND
J7 = CON FFC22_FH55-22S-0.5SH_Inverted: FFC Connector 0.5mm shielded; KHK Part Number: 10357; Manufacturer: Hirose; Manufacturer Part Number: FH55-22S-0.5SH; Supplier 1: Mouser; Supplier Part Number 1: 798-FH55-22S-0.5SH
J10 J11 = CON 1x4 2.54 several: Header Vertical, 1x4 Pos, Pitch 2.54mm, Contact Length Mating 6.00mm, Contact Length Post 3.00mm, Insulation Height 2.54mm, Gold Plating; KHK Part Number: 15343; Manufacturer: several; Manufacturer Part Number: several; Supplier 1: Digi-Key; Supplier Part Number 1: 732-5317-ND
R18 R33 R34 R36 R37 R39 R40 R42 R49 R50 = R X 0603: as R15 on sheet CSI2-ZCU106-EVK-1_Rev01
R21 R35 R38 R41 R47 R48 = R 0R0 1% 0603: as R6 on sheet CSI2-ZCU106-EVK-1_Rev01; Manufacturer Part Number: several; Temperature Coefficient: *; Supplier 1: Digi-Key; Supplier Part Number 1: 311-0.0HRCT-ND
R43 = R 1k5 1% 0402: Standard Resistor SMD/0402/1%/63mW/TK100; KHK Part Number: K8250358; Manufacturer: several; Tolerance: 1%; Manufacturer Part Number: several; Supplier 1: Digi-Key; Supplier Part Number 1: 311-1.50KLRCT-ND
R44 = R 270K 1% 0402: Standard Resistor SMD/0402/1%/63mW/TK100; KHK Part Number: 3875; Manufacturer: several; Tolerance: 1%; Temperature Coefficient: TK100; Manufacturer Part Number: several; Supplier 1: Digi-Key; Supplier Part Number 1: CR0402-FX-2703GLFCT-ND
R45 = R 3K3 1% 0402: Standard Resistor SMD/0402/1%/63mW/TK100; KHK Part Number: K8250347; Manufacturer: several; Tolerance: 1%; Temperature Coefficient: TK100; Manufacturer Part Number: several; Supplier 1: Digi-Key; Supplier Part Number 1: 311-3.30KLRCT-ND
R46 = R 51K 1% 0402: Standard Resistor SMD/0402/1%/63mW/TK100; KHK Part Number: K8250273; Manufacturer: several; Tolerance: 1%; Temperature Coefficient: TK100; Manufacturer Part Number: several; Supplier 1: Digi-Key; Supplier Part Number 1: 311-51.0KLRCT-ND
R51 = R 200K 1% 0402: Standard Resistor SMD/0402/1%/63mW/TK100; KHK Part Number: K8250280; Manufacturer: several; Temperature Coefficient: TK100; Tolerance: 1%; Manufacturer Part Number: several; Supplier 1: Digi-Key; Supplier 2: Arrow; Supplier 3: Arrow; Supplier Part Number 1: 311-200KLRCT-ND; Supplier Part Number 2: CRCW0402200KFKED; Supplier Part Number 3: NRC04F2003TRF
R52-R55 = R 2k0 1% 0402: Standard Resistor SMD/0402/1%/63mW/TK100; KHK Part Number: K8250311; Manufacturer: several; Temperature Coefficient: TK100; Tolerance: 1%; Manufacturer Part Number: several; Supplier 1: Digi-Key; Supplier Part Number 1: 311-2KLRCT-ND
TP4-TP6 = TP_16_10: Testpoint: Pad=1,6mm; Hole=1,0mm
U6 = IC INA260: IC/PWR/CURR SHUNT MONITOR/2.7-5.5V;4.5mR/TSSOP16/5.0x4.4x1.2mm; Manufacturer: TI; Manufacturer Part Number: INA260AIPWR; Supplier 1: Digi-Key; Supplier Part Number 1: 296-47777-1-ND
U7 = IC  TPS25200DRVT: IC/PWR/LOADSW;2V5-6V5;2A5;0R099/6-WDFN/2x2x0.8mm; KHK Part Number: 14277; Manufacturer: Texas Instruments; I max: 2.5A; Manufacturer Part Number: TPS25200DRVT; Supplier 1: Digi-Key; Supplier Part Number 1: 296-37760-1-ND
U8 = IC PCA9306DCTR: IC/LOGIC/LEVELSHIFTER;I2C;AUTO-DIR;1V2-5V/SSOP-8/4.25x3.15x1.3mm; KHK Part Number: 9555; Manufacturer: TI; Manufacturer Part Number: PCA9306DCTR; Supplier 1: Digi-Key; Supplier Part Number 1: 296-18509-1-ND
U9 = IC NTB0104GU12,115: IC/LOGIC/Levelshifter;Auto-Dir;Bidirectional;Push-Pull;-40-+125°C/; Manufacturer: NXP; KHK Part Number: 14383; Manufacturer Part Number: NTB0104GU12,115; Supplier 1: Digi-Key; Supplier Part Number 1: 568-5204-1-ND

## Nets that join several sheets
GND: CSI2-ZCU106-EVK-1_Rev01 (177 pins), CAM1 (24 pins), CAM2 (24 pins), CAM3 (24 pins), CAM4 (24 pins)
VCC1V2: CSI2-ZCU106-EVK-1_Rev01 (R17.2), CAM1 (7 pins), CAM2 (7 pins), CAM3 (7 pins), CAM4 (7 pins)
VCC3V3: CSI2-ZCU106-EVK-1_Rev01 (9 pins), CAM1 (9 pins), CAM2 (9 pins), CAM3 (9 pins), CAM4 (9 pins)
VCC5V-EXT: CSI2-ZCU106-EVK-1_Rev01 (Q2.S R31.1), CAM1 (6 pins), CAM2 (6 pins), CAM3 (6 pins), CAM4 (6 pins)
B7-CSI2-TXC_N: CSI2-ZCU106-EVK-1_Rev01 (J1.G7), CAM1 (J7_CAM1.14)
B7-CSI2-TXC_N: CSI2-ZCU106-EVK-1_Rev01 (J1.H8), CAM2 (J7_CAM2.14)
B7-CSI2-TXC_N: CSI2-ZCU106-EVK-1_Rev01 (J1.G28), CAM3 (J7_CAM3.14)
B7-CSI2-TXC_N: CSI2-ZCU106-EVK-1_Rev01 (J1.G34), CAM4 (J7_CAM4.14)
B7-CSI2-TXC_P: CSI2-ZCU106-EVK-1_Rev01 (J1.G6), CAM1 (J7_CAM1.15)
B7-CSI2-TXC_P: CSI2-ZCU106-EVK-1_Rev01 (J1.H7), CAM2 (J7_CAM2.15)
B7-CSI2-TXC_P: CSI2-ZCU106-EVK-1_Rev01 (J1.G27), CAM3 (J7_CAM3.15)
B7-CSI2-TXC_P: CSI2-ZCU106-EVK-1_Rev01 (J1.G33), CAM4 (J7_CAM4.15)
B7-CSI2-TXD0_N: CSI2-ZCU106-EVK-1_Rev01 (J1.D18), CAM1 (J7_CAM1.20)
B7-CSI2-TXD0_N: CSI2-ZCU106-EVK-1_Rev01 (J1.D27), CAM3 (J7_CAM3.20)
B7-CSI2-TXD0_N: CSI2-ZCU106-EVK-1_Rev01 (J1.G10), CAM2 (J7_CAM2.20)
B7-CSI2-TXD0_N: CSI2-ZCU106-EVK-1_Rev01 (J1.G37), CAM4 (J7_CAM4.20)
B7-CSI2-TXD0_P: CSI2-ZCU106-EVK-1_Rev01 (J1.D17), CAM1 (J7_CAM1.21)
B7-CSI2-TXD0_P: CSI2-ZCU106-EVK-1_Rev01 (J1.D26), CAM3 (J7_CAM3.21)
B7-CSI2-TXD0_P: CSI2-ZCU106-EVK-1_Rev01 (J1.G9), CAM2 (J7_CAM2.21)
B7-CSI2-TXD0_P: CSI2-ZCU106-EVK-1_Rev01 (J1.G36), CAM4 (J7_CAM4.21)
B7-CSI2-TXD1_N: CSI2-ZCU106-EVK-1_Rev01 (J1.C11), CAM1 (J7_CAM1.17)
B7-CSI2-TXD1_N: CSI2-ZCU106-EVK-1_Rev01 (J1.D12), CAM2 (J7_CAM2.17)
B7-CSI2-TXD1_N: CSI2-ZCU106-EVK-1_Rev01 (J1.H29), CAM3 (J7_CAM3.17)
B7-CSI2-TXD1_N: CSI2-ZCU106-EVK-1_Rev01 (J1.H38), CAM4 (J7_CAM4.17)
B7-CSI2-TXD1_P: CSI2-ZCU106-EVK-1_Rev01 (J1.C10), CAM1 (J7_CAM1.18)
B7-CSI2-TXD1_P: CSI2-ZCU106-EVK-1_Rev01 (J1.D11), CAM2 (J7_CAM2.18)
B7-CSI2-TXD1_P: CSI2-ZCU106-EVK-1_Rev01 (J1.H28), CAM3 (J7_CAM3.18)
B7-CSI2-TXD1_P: CSI2-ZCU106-EVK-1_Rev01 (J1.H37), CAM4 (J7_CAM4.18)
B7-CSI2-TXD2_N: CSI2-ZCU106-EVK-1_Rev01 (J1.D9), CAM1 (J7_CAM1.11)
B7-CSI2-TXD2_N: CSI2-ZCU106-EVK-1_Rev01 (J1.C15), CAM2 (J7_CAM2.11)
B7-CSI2-TXD2_N: CSI2-ZCU106-EVK-1_Rev01 (J1.H26), CAM3 (J7_CAM3.11)
B7-CSI2-TXD2_N: CSI2-ZCU106-EVK-1_Rev01 (J1.H35), CAM4 (J7_CAM4.11)
B7-CSI2-TXD2_P: CSI2-ZCU106-EVK-1_Rev01 (J1.D8), CAM1 (J7_CAM1.12)
B7-CSI2-TXD2_P: CSI2-ZCU106-EVK-1_Rev01 (J1.C14), CAM2 (J7_CAM2.12)
B7-CSI2-TXD2_P: CSI2-ZCU106-EVK-1_Rev01 (J1.H25), CAM3 (J7_CAM3.12)
B7-CSI2-TXD2_P: CSI2-ZCU106-EVK-1_Rev01 (J1.H34), CAM4 (J7_CAM4.12)
B7-CSI2-TXD3_N: CSI2-ZCU106-EVK-1_Rev01 (J1.C27), CAM3 (J7_CAM3.8)
B7-CSI2-TXD3_N: CSI2-ZCU106-EVK-1_Rev01 (J1.G3), CAM4 (J7_CAM4.8)
B7-CSI2-TXD3_N: CSI2-ZCU106-EVK-1_Rev01 (J1.H14), CAM2 (J7_CAM2.8)
B7-CSI2-TXD3_N: CSI2-ZCU106-EVK-1_Rev01 (J1.G16), CAM1 (J7_CAM1.8)
B7-CSI2-TXD3_P: CSI2-ZCU106-EVK-1_Rev01 (J1.C26), CAM3 (J7_CAM3.9)
B7-CSI2-TXD3_P: CSI2-ZCU106-EVK-1_Rev01 (J1.G2), CAM4 (J7_CAM4.9)
B7-CSI2-TXD3_P: CSI2-ZCU106-EVK-1_Rev01 (J1.H13), CAM2 (J7_CAM2.9)
B7-CSI2-TXD3_P: CSI2-ZCU106-EVK-1_Rev01 (J1.G15), CAM1 (J7_CAM1.9)
GPIO2: CSI2-ZCU106-EVK-1_Rev01 (J1.D14), CAM3 (U9_CAM3.2)
GPIO2: CSI2-ZCU106-EVK-1_Rev01 (J1.C18), CAM1 (U9_CAM1.2)
GPIO2: CSI2-ZCU106-EVK-1_Rev01 (J1.H10), CAM2 (U9_CAM2.2)
GPIO2: CSI2-ZCU106-EVK-1_Rev01 (J1.H31), CAM4 (U9_CAM4.2)
GPIO3: CSI2-ZCU106-EVK-1_Rev01 (J1.D15), CAM3 (U9_CAM3.3)
GPIO3: CSI2-ZCU106-EVK-1_Rev01 (J1.C19), CAM1 (U9_CAM1.3)
GPIO3: CSI2-ZCU106-EVK-1_Rev01 (J1.H11), CAM2 (U9_CAM2.3)
GPIO3: CSI2-ZCU106-EVK-1_Rev01 (J1.H32), CAM4 (U9_CAM4.3)
I2C_SCL: CSI2-ZCU106-EVK-1_Rev01 (J1.D20), CAM3 (R53_CAM3.2 TP6_CAM3.1 U8_CAM3.3)
I2C_SCL: CSI2-ZCU106-EVK-1_Rev01 (J1.H16), CAM1 (R53_CAM1.2 TP6_CAM1.1 U8_CAM1.3)
I2C_SCL: CSI2-ZCU106-EVK-1_Rev01 (J1.G18), CAM2 (R53_CAM2.2 TP6_CAM2.1 U8_CAM2.3)
I2C_SCL: CSI2-ZCU106-EVK-1_Rev01 (J1.G30), CAM4 (R53_CAM4.2 TP6_CAM4.1 U8_CAM4.3)
I2C_SDA: CSI2-ZCU106-EVK-1_Rev01 (J1.D21), CAM3 (R52_CAM3.2 TP5_CAM3.1 U8_CAM3.4)
I2C_SDA: CSI2-ZCU106-EVK-1_Rev01 (J1.H17), CAM1 (R52_CAM1.2 TP5_CAM1.1 U8_CAM1.4)
I2C_SDA: CSI2-ZCU106-EVK-1_Rev01 (J1.G19), CAM2 (R52_CAM2.2 TP5_CAM2.1 U8_CAM2.4)
I2C_SDA: CSI2-ZCU106-EVK-1_Rev01 (J1.G31), CAM4 (R52_CAM4.2 TP5_CAM4.1 U8_CAM4.4)
LA08_P: CSI2-ZCU106-EVK-1_Rev01 (J1.G12), CAM1 (U9_CAM1.4)
LA15_P: CSI2-ZCU106-EVK-1_Rev01 (J1.H19), CAM2 (U9_CAM2.4)
LA22_P: CSI2-ZCU106-EVK-1_Rev01 (J1.G24), CAM3 (U9_CAM3.4)
LA23_P: CSI2-ZCU106-EVK-1_Rev01 (J1.D23), CAM4 (U9_CAM4.4)

## Assembly variants
standard: not fitted J10_CAM1 J10_CAM2 J10_CAM3 J10_CAM4